# EAGLE design BUZZI-01 (EAGLE 4.15)
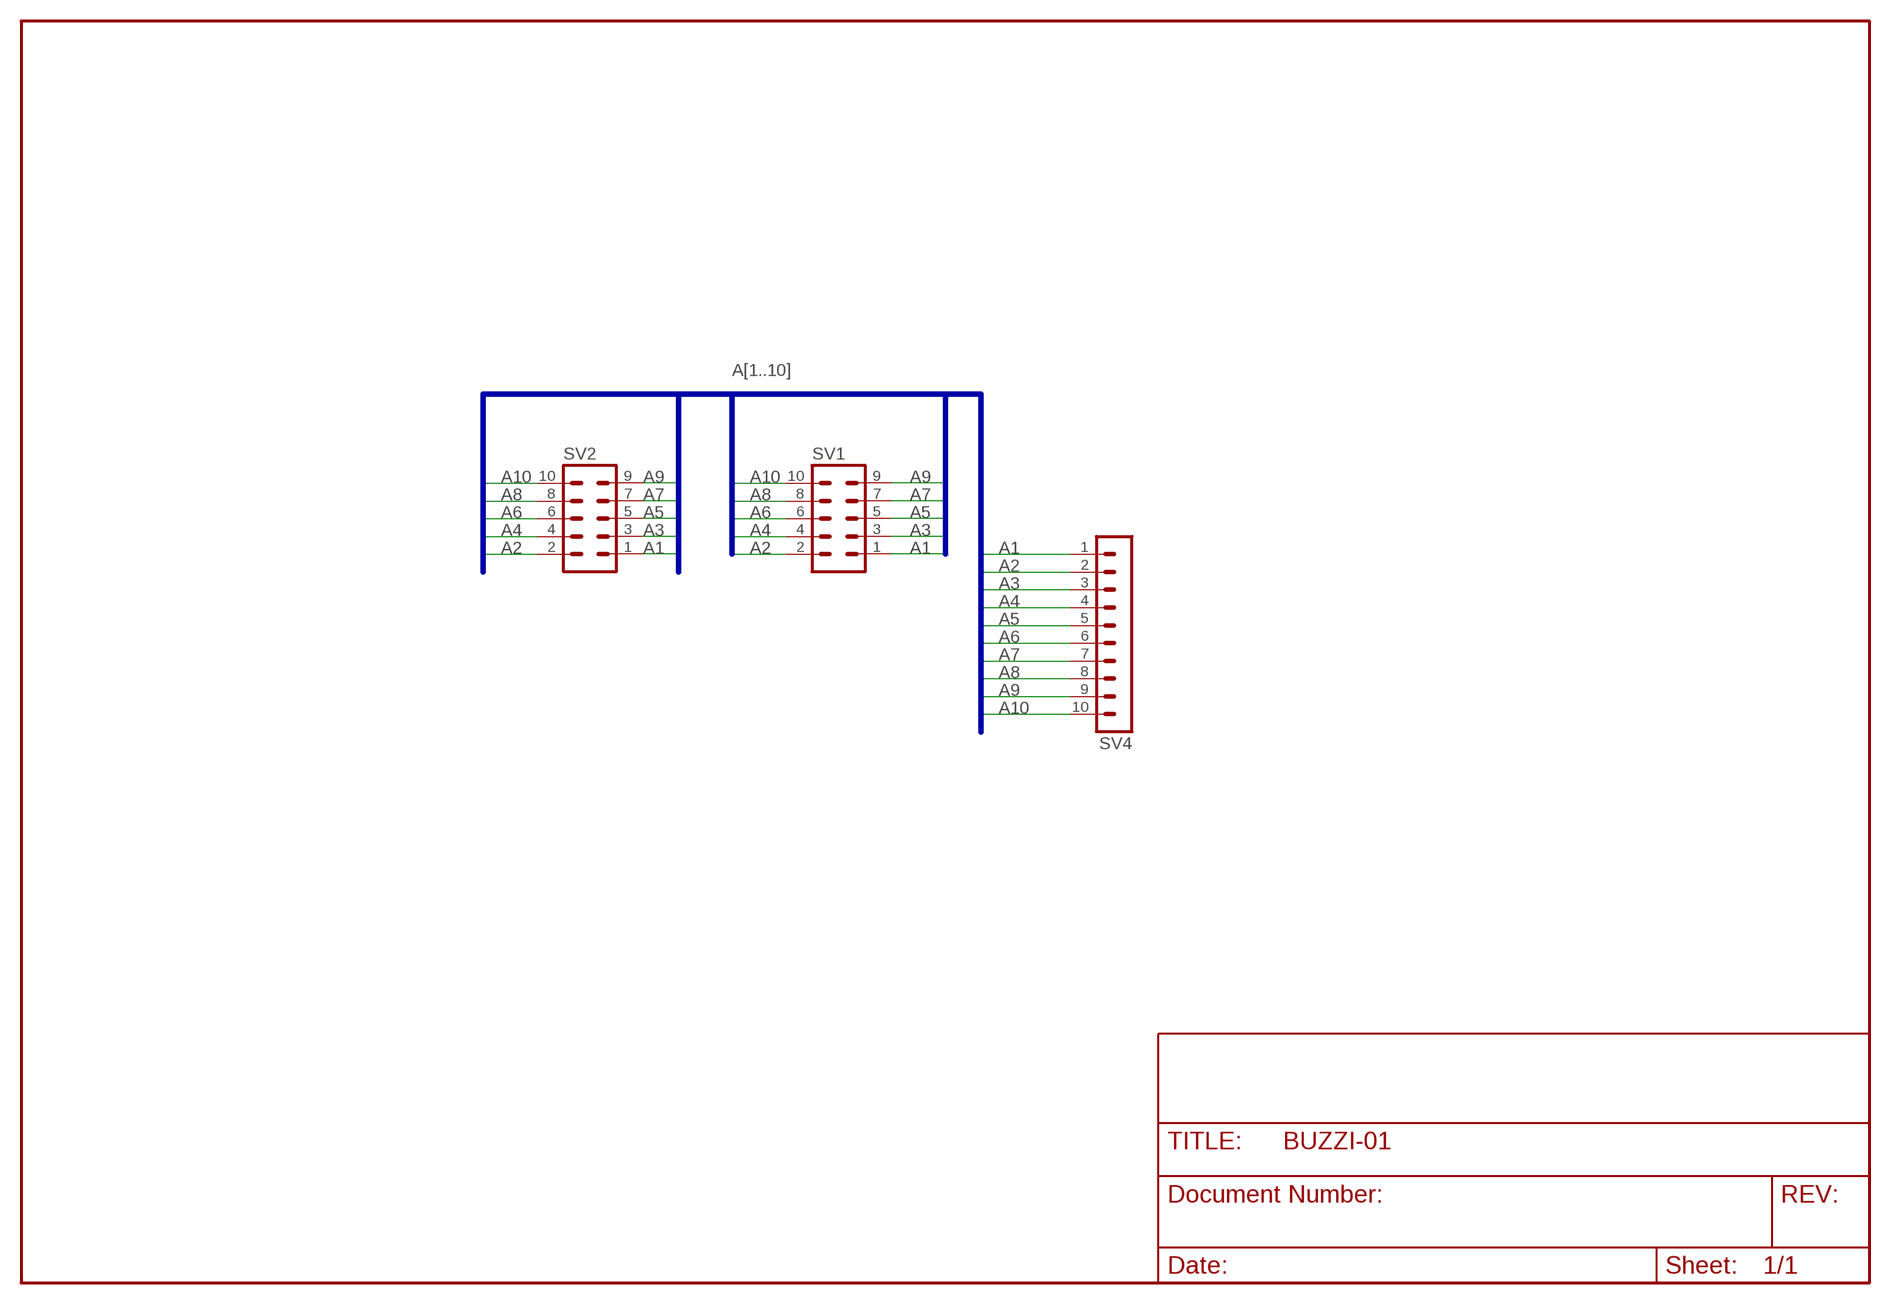
[diagram p0: schematic, sheet 1]

## Parts
SV1  ML10  [ML10]
SV2  ML10  [ML10]
SV4  MA10-1  [MA10-1]

## Nets
A1: SV1.1 SV2.1 SV4.1
A2: SV1.2 SV2.2 SV4.2
A3: SV1.3 SV2.3 SV4.3
A4: SV1.4 SV2.4 SV4.4
A5: SV1.5 SV2.5 SV4.5
A6: SV1.6 SV2.6 SV4.6
A7: SV1.7 SV2.7 SV4.7
A8: SV1.8 SV2.8 SV4.8
A9: SV1.9 SV2.9 SV4.9
A10: SV1.10 SV2.10 SV4.10

## Buses
A[1..10]

## Library data of the parts
SV1 SV2 = con-harting-ml:ML10: HARTING
SV4 = con-lstb:MA10-1: PIN HEADER

## Net classes
0 default: width 0.5 mm

## Board
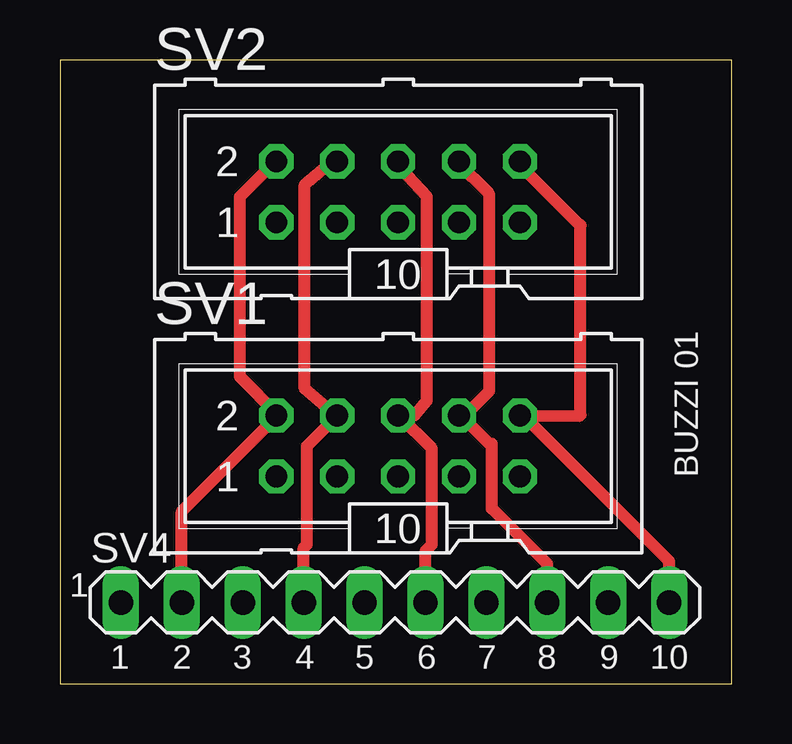
[diagram p1: board, top side]
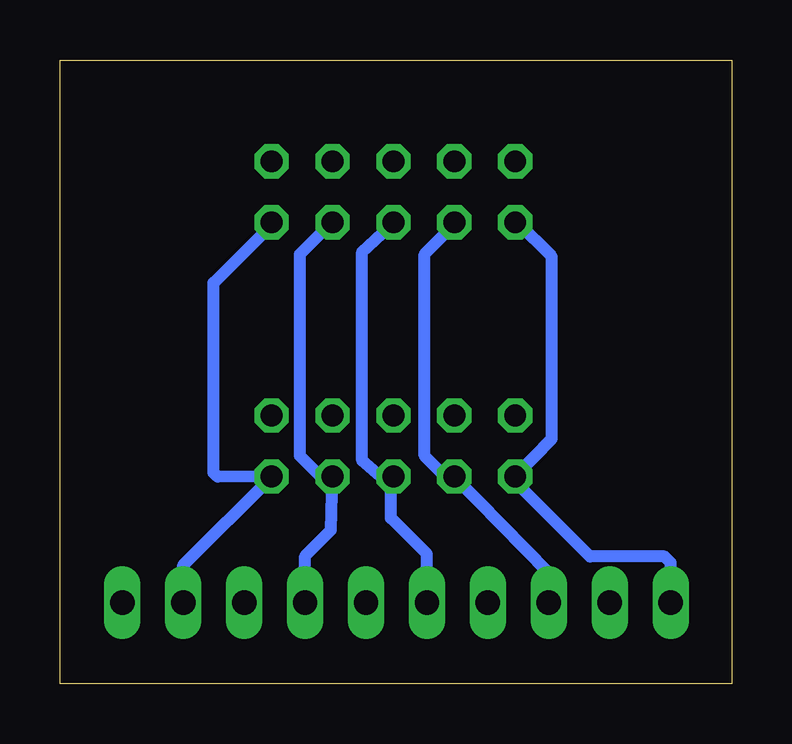
[diagram p2: board, bottom side, seen from below]

Size 28 x 26 mm. Coordinates in mm from the lower left corner, seen from the top.
Outline: 0,0 28,0 28,26 0,26 0,0
Copper layers (1*16): Top 0.035mm / dielectric 1.5mm / Bottom 0.035mm
Design rules "default": minimum track width 10mil, minimum drill 24mil, track to track 8mil, track to pad 8mil, pad to pad 8mil, via to via 8mil, smd to smd 8mil, copper to edge 40mil, drill to drill 8mil, minimum pad ring 10mil, minimum via ring 8mil, stop-mask expansion 4mil, vias tented up to drill 0mil, thermal gap 10mil

### Footprints (pad centres in the part's own frame; a part is rotated, then mirrored left to right if it is on the bottom)
ML10 = drill 0.914 octagon: 1 -5.08,-1.27; 2 -5.08,1.27; 3 -2.54,-1.27; 4 -2.54,1.27; 5 0,-1.27; 6 0,1.27; 7 2.54,-1.27; 8 2.54,1.27; 9 5.08,-1.27; 10 5.08,1.27
MA10-1 = drill 1.016 long: 1 -11.43,0; 2 -8.89,0; 3 -6.35,0; 4 -3.81,0; 5 -1.27,0; 6 1.27,0; 7 3.81,0; 8 6.35,0; 9 8.89,0; 10 11.43,0

### Placement (x,y rotation side)
SV1  14.1,9.9 0 top
SV2  14.1,20.5 0 top
SV4  13.97,3.38 0 top

### Tracks (layer width: path | path; a pad name or v marks a point on that pad's centre or on a via)
A1
  Bottom 0.5: SV4.1 2.54,5.04 2.8,5.3 5.9,5.3 9.2,8.6 9.18,8.62 SV1.1 7.5,10.2 7.5,17.8 8.92,19.22 SV2.1
A2
  Top 0.5: 9.08,11.18 9.1,11.2 | 9.08,11.18 SV1.2 9.08,11.22 7.5,12.8 7.5,20.3 8.97,21.77 | SV4.2 5.08,7.18 9.08,11.18 | 9,21.8 8.97,21.77 | 8.97,21.77 SV2.2
A3
  Bottom 0.5: SV4.3 7.62,4.62 SV1.3 11.92,8.62 12.8,9.5 12.8,17.9 11.47,19.23 SV2.3
A4
  Top 0.5: SV4.4 10.16,5.66 10.3,5.8 10.3,9.9 11.6,11.2 11.62,11.18 SV1.4 11.54,11.16 10.2,12.3 10.2,20.8 11.46,21.86 | 11.5,21.9 11.46,21.86 | 11.46,21.86 SV2.4
A5
  Bottom 0.5: SV4.5 12.7,5.4 14.2,6.9 14.2,8.6 14.18,8.62 SV1.5 14.62,8.62 15.4,9.3 15.4,18 14,19.3 SV2.5
A6
  Top 0.5: SV4.6 15.24,5.54 15.5,5.8 15.5,9.8 14.16,11.14 SV1.6 14.76,11.16 15.3,11.8 15.3,20.3 14,21.7 SV2.6
A7
  Bottom 0.5: SV4.7 17.78,5.32 16.7,6.4 SV1.7 17.12,8.62 18,9.5 18,17.9 16.6,19.3 16.54,19.24 SV2.7
A8
  Top 0.5: SV4.8 20.32,4.98 18,7.3 18,10 17.9,10 16.7,11.2 | 16.7,11.2 SV1.8 | 16.7,11.2 16.9,11.2 17.9,12.2 17.9,20.4 16.53,21.77 | 16.53,21.77 16.5,21.8 | 16.53,21.77 SV2.8
A9
  Bottom 0.5: SV1.9 19.1,8.7 | SV1.9 21.42,8.62 21.6,8.8 21.6,16.7 19.08,19.22 SV2.9 | SV4.9 22.86,4.94 SV1.9
A10
  Top 0.5: SV4.10 25.4,5.1 19.3,11.2 19.26,11.16 SV1.10 21.66,11.16 21.7,11.2 21.7,19.1 19.03,21.77 | 19.03,21.77 19,21.8 | 19.03,21.77 SV2.10

### Text on the board
tPlace: BUZZI 01 | 1 | 2 | 3 | 4 | 5 | 6 | 7 | 8 | 9 | 10